# Altium schematic sheet UAV_Main.SchDoc
size 599 x 500 mm; SheetNumber: 1; SheetTotal: 12
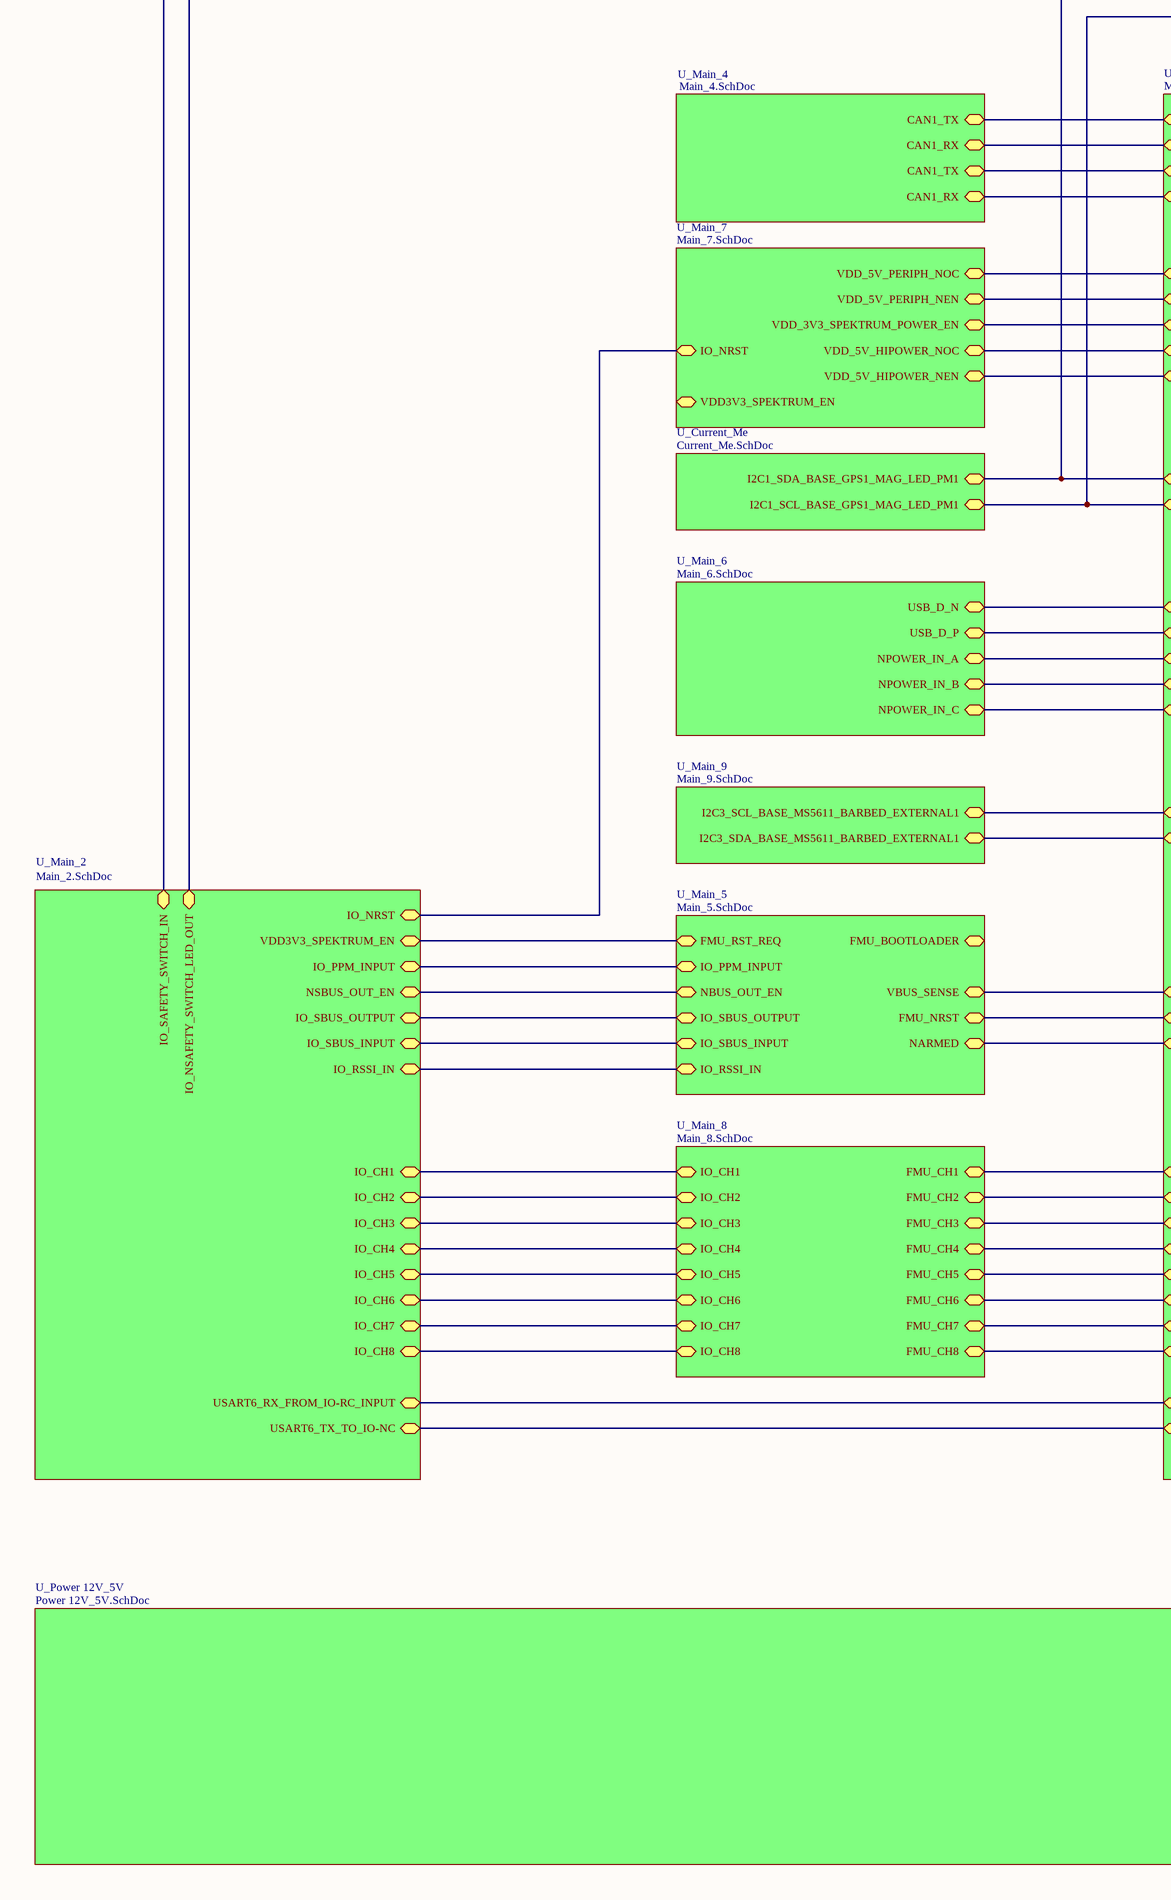
[diagram p0: UAV_Main.SchDoc, left]
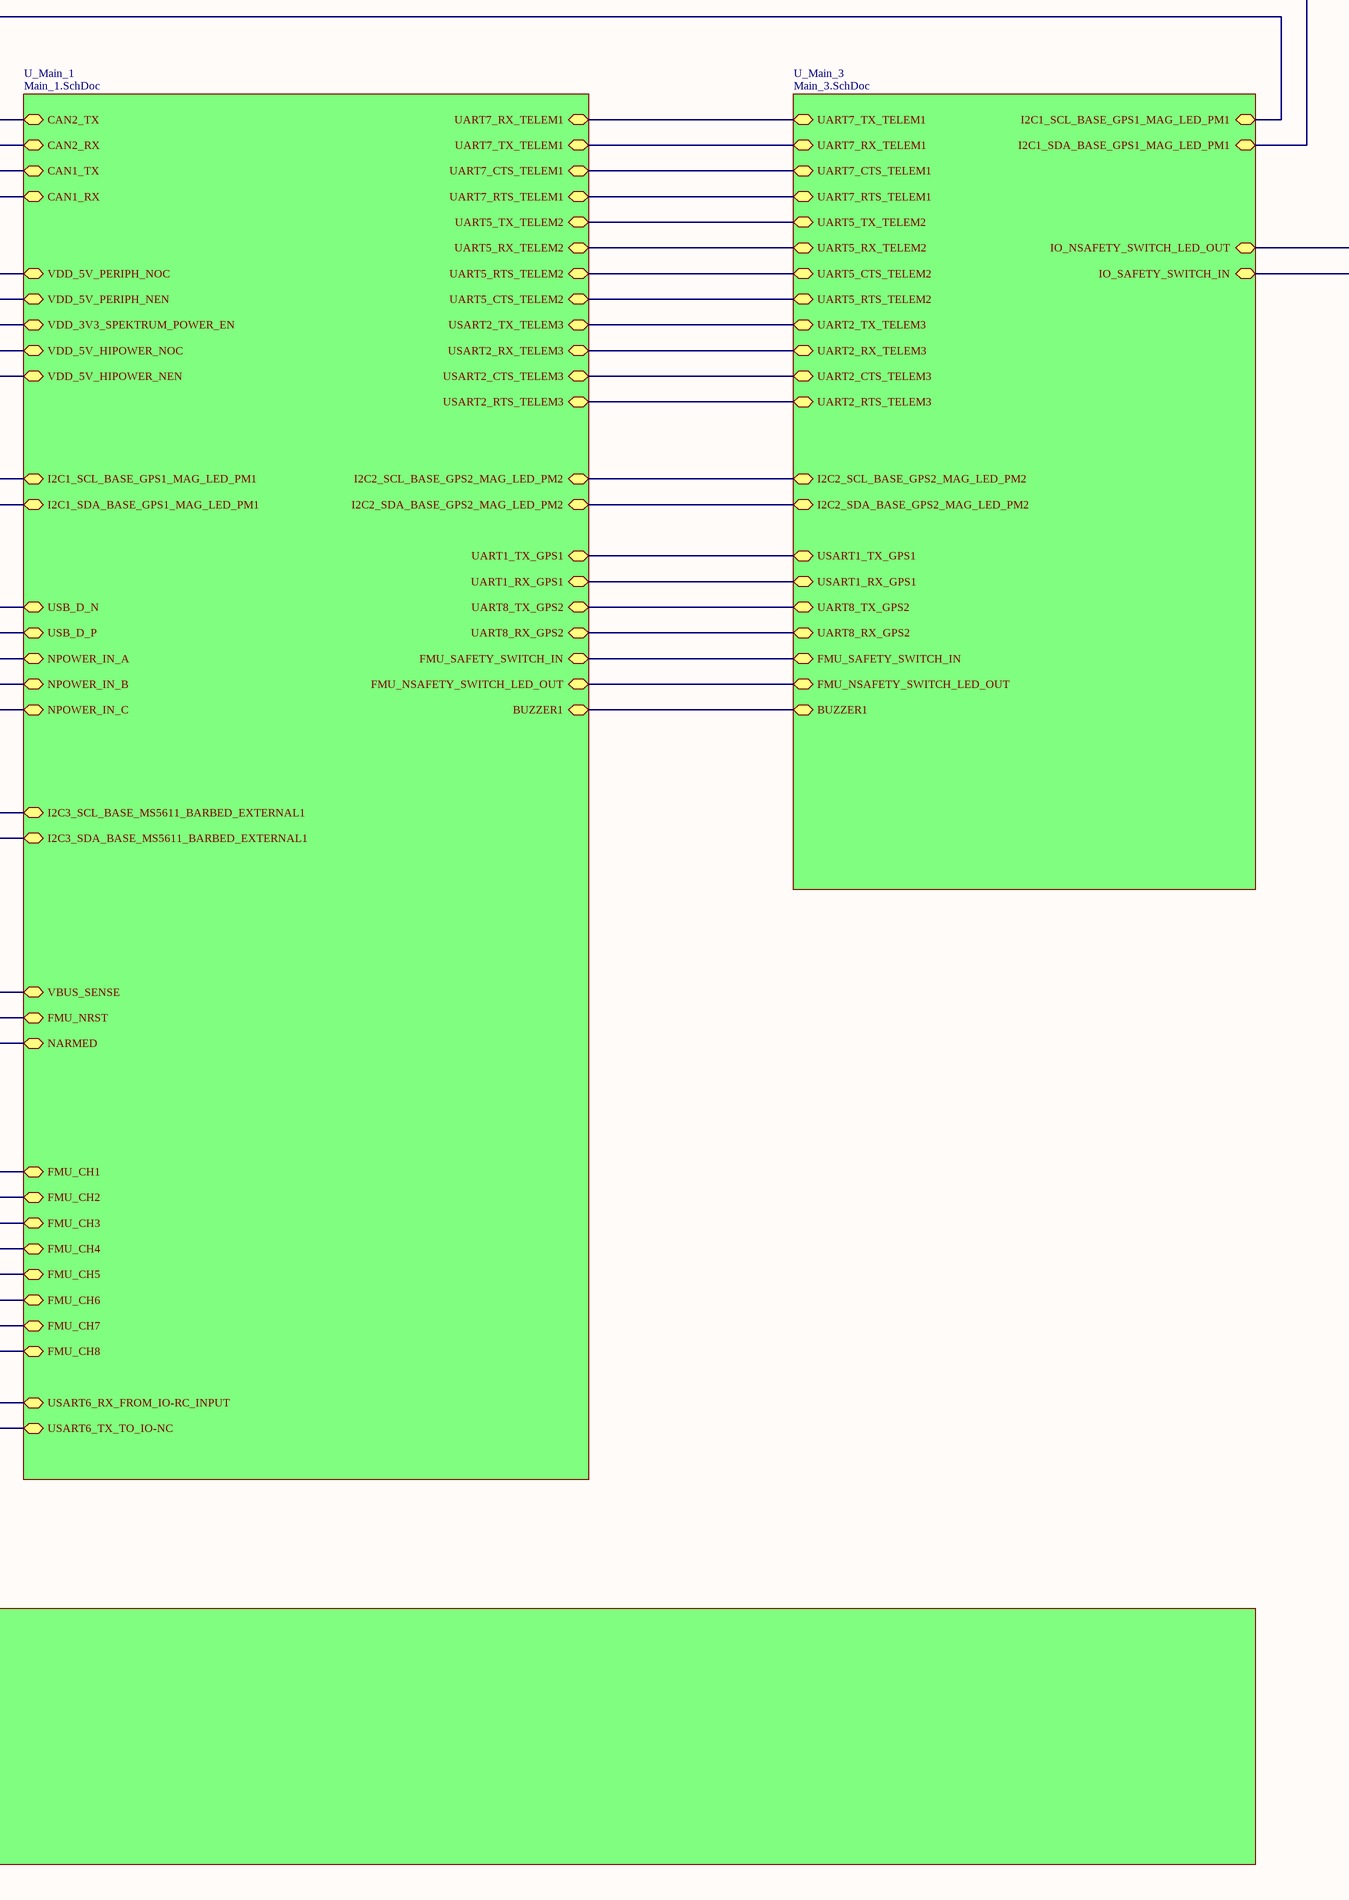
[diagram p1: UAV_Main.SchDoc, right]

## Sub-sheets
U_Current_Me = Current_Me.SchDoc: I2C1_SCL_BASE_GPS1_MAG_LED_PM1 (bidir), I2C1_SDA_BASE_GPS1_MAG_LED_PM1 (bidir)
U_Main_1 = Main_1.SchDoc: FMU_CH5 (bidir), FMU_CH6 (bidir), FMU_CH7 (bidir), FMU_CH8 (bidir), FMU_CH1 (bidir), FMU_CH2 (bidir), FMU_CH3 (bidir), FMU_CH4 (bidir), CAN2_TX (bidir), CAN2_RX (bidir), FMU_NSAFETY_SWITCH_LED_OUT (bidir), VDD_3V3_SPEKTRUM_POWER_EN (bidir), VDD_5V_PERIPH_NEN (bidir), VDD_5V_PERIPH_NOC (bidir), CAN1_TX (bidir), CAN1_RX (bidir), VDD_5V_HIPOWER_NEN (bidir), VDD_5V_HIPOWER_NOC (bidir), NARMED (bidir), FMU_NRST (bidir), NPOWER_IN_A (bidir), NPOWER_IN_B (bidir), NPOWER_IN_C (bidir), USB_D_P (bidir), USB_D_N (bidir), VBUS_SENSE (bidir), USART6_RX_FROM_IO-RC_INPUT (bidir), USART6_TX_TO_IO-NC (bidir), UART7_TX_TELEM1 (bidir), UART7_RX_TELEM1 (bidir), UART5_TX_TELEM2 (bidir), UART5_RX_TELEM2 (bidir), UART5_RTS_TELEM2 (bidir), UART5_CTS_TELEM2 (bidir), USART2_TX_TELEM3 (bidir), USART2_RX_TELEM3 (bidir), USART2_RTS_TELEM3 (bidir), USART2_CTS_TELEM3 (bidir), UART1_RX_GPS1 (bidir), UART1_TX_GPS1 (bidir), UART8_TX_GPS2 (bidir), UART8_RX_GPS2 (bidir), UART7_RTS_TELEM1 (bidir), UART7_CTS_TELEM1 (bidir), I2C1_SCL_BASE_GPS1_MAG_LED_PM1 (bidir), I2C1_SDA_BASE_GPS1_MAG_LED_PM1 (bidir), I2C2_SCL_BASE_GPS2_MAG_LED_PM2 (bidir), I2C2_SDA_BASE_GPS2_MAG_LED_PM2 (bidir), I2C3_SCL_BASE_MS5611_BARBED_EXTERNAL1 (bidir), I2C3_SDA_BASE_MS5611_BARBED_EXTERNAL1 (bidir), BUZZER1 (bidir), FMU_SAFETY_SWITCH_IN (bidir)
U_Main_2 = Main_2.SchDoc: IO_NRST (bidir), VDD3V3_SPEKTRUM_EN (bidir), IO_NSAFETY_SWITCH_LED_OUT (bidir), IO_SBUS_INPUT (bidir), IO_SBUS_OUTPUT (bidir), IO_CH3 (bidir), IO_CH4 (bidir), IO_SAFETY_SWITCH_IN (bidir), NSBUS_OUT_EN (bidir), IO_CH7 (bidir), IO_CH8 (bidir), IO_CH1 (bidir), IO_CH2 (bidir), USART6_RX_FROM_IO-RC_INPUT (bidir), USART6_TX_TO_IO-NC (bidir), IO_RSSI_IN (bidir), IO_CH5 (bidir), IO_CH6 (bidir), IO_PPM_INPUT (bidir)
U_Main_3 = Main_3.SchDoc: UART7_TX_TELEM1 (bidir), UART7_RX_TELEM1 (bidir), UART7_CTS_TELEM1 (bidir), UART7_RTS_TELEM1 (bidir), UART5_TX_TELEM2 (bidir), UART5_RX_TELEM2 (bidir), UART5_CTS_TELEM2 (bidir), UART5_RTS_TELEM2 (bidir), UART2_TX_TELEM3 (bidir), UART2_RX_TELEM3 (bidir), UART2_CTS_TELEM3 (bidir), UART2_RTS_TELEM3 (bidir), USART1_TX_GPS1 (bidir), USART1_RX_GPS1 (bidir), I2C1_SCL_BASE_GPS1_MAG_LED_PM1 (bidir), I2C1_SDA_BASE_GPS1_MAG_LED_PM1 (bidir), IO_SAFETY_SWITCH_IN (bidir), FMU_SAFETY_SWITCH_IN (bidir), FMU_NSAFETY_SWITCH_LED_OUT (bidir), IO_NSAFETY_SWITCH_LED_OUT (bidir), BUZZER1 (bidir), UART8_TX_GPS2 (bidir), UART8_RX_GPS2 (bidir), I2C2_SCL_BASE_GPS2_MAG_LED_PM2 (bidir), I2C2_SDA_BASE_GPS2_MAG_LED_PM2 (bidir)
U_Main_4 = Main_4.SchDoc: CAN1_TX (bidir), CAN1_RX (bidir), CAN1_TX (bidir), CAN1_RX (bidir)
U_Main_5 = Main_5.SchDoc: FMU_BOOTLOADER (bidir), VBUS_SENSE (bidir), FMU_NRST (bidir), NARMED (bidir), FMU_RST_REQ (bidir), IO_PPM_INPUT (bidir), NBUS_OUT_EN (bidir), IO_SBUS_INPUT (bidir), IO_SBUS_OUTPUT (bidir), IO_RSSI_IN (bidir)
U_Main_6 = Main_6.SchDoc: USB_D_N (bidir), USB_D_P (bidir), NPOWER_IN_A (bidir), NPOWER_IN_B (bidir), NPOWER_IN_C (bidir)
U_Main_7 = Main_7.SchDoc: VDD3V3_SPEKTRUM_EN (bidir), VDD_3V3_SPEKTRUM_POWER_EN (bidir), VDD_5V_HIPOWER_NOC (bidir), VDD_5V_HIPOWER_NEN (bidir), IO_NRST (bidir), VDD_5V_PERIPH_NEN (bidir), VDD_5V_PERIPH_NOC (bidir)
U_Main_8 = Main_8.SchDoc: IO_CH5 (bidir), IO_CH6 (bidir), IO_CH7 (bidir), IO_CH8 (bidir), IO_CH1 (bidir), IO_CH2 (bidir), IO_CH3 (bidir), IO_CH4 (bidir), FMU_CH1 (bidir), FMU_CH2 (bidir), FMU_CH3 (bidir), FMU_CH4 (bidir), FMU_CH8 (bidir), FMU_CH7 (bidir), FMU_CH6 (bidir), FMU_CH5 (bidir)
U_Main_9 = Main_9.SchDoc: I2C3_SCL_BASE_MS5611_BARBED_EXTERNAL1 (bidir), I2C3_SDA_BASE_MS5611_BARBED_EXTERNAL1 (bidir)
U_Power 12V_5V = Power 12V_5V.SchDoc: no entries

## Nets
(unnamed): sheet U_Main_8/IO_CH5, sheet U_Main_2/IO_CH5
(unnamed): sheet U_Main_8/IO_CH6, sheet U_Main_2/IO_CH6
(unnamed): sheet U_Main_8/IO_CH7, sheet U_Main_2/IO_CH7
(unnamed): sheet U_Main_8/IO_CH8, sheet U_Main_2/IO_CH8
(unnamed): sheet U_Main_8/IO_CH1, sheet U_Main_2/IO_CH1
(unnamed): sheet U_Main_8/IO_CH2, sheet U_Main_2/IO_CH2
(unnamed): sheet U_Main_8/IO_CH3, sheet U_Main_2/IO_CH3
(unnamed): sheet U_Main_8/IO_CH4, sheet U_Main_2/IO_CH4
(unnamed): sheet U_Main_8/FMU_CH1, sheet U_Main_1/FMU_CH1
(unnamed): sheet U_Main_8/FMU_CH2, sheet U_Main_1/FMU_CH2
(unnamed): sheet U_Main_8/FMU_CH3, sheet U_Main_1/FMU_CH3
(unnamed): sheet U_Main_8/FMU_CH4, sheet U_Main_1/FMU_CH4
(unnamed): sheet U_Main_8/FMU_CH8, sheet U_Main_1/FMU_CH8
(unnamed): sheet U_Main_8/FMU_CH7, sheet U_Main_1/FMU_CH7
(unnamed): sheet U_Main_8/FMU_CH6, sheet U_Main_1/FMU_CH6
(unnamed): sheet U_Main_8/FMU_CH5, sheet U_Main_1/FMU_CH5
(unnamed): sheet U_Main_6/USB_D_N, sheet U_Main_1/USB_D_N
(unnamed): sheet U_Main_6/USB_D_P, sheet U_Main_1/USB_D_P
(unnamed): sheet U_Main_6/NPOWER_IN_A, sheet U_Main_1/NPOWER_IN_A
(unnamed): sheet U_Main_6/NPOWER_IN_B, sheet U_Main_1/NPOWER_IN_B
(unnamed): sheet U_Main_6/NPOWER_IN_C, sheet U_Main_1/NPOWER_IN_C
(unnamed): sheet U_Main_4/CAN1_TX, sheet U_Main_1/CAN2_TX
(unnamed): sheet U_Main_4/CAN1_RX, sheet U_Main_1/CAN2_RX
(unnamed): sheet U_Main_4/CAN1_TX, sheet U_Main_1/CAN1_TX
(unnamed): sheet U_Main_4/CAN1_RX, sheet U_Main_1/CAN1_RX
(unnamed): sheet U_Main_2/IO_NRST, sheet U_Main_7/IO_NRST
(unnamed): sheet U_Main_2/VDD3V3_SPEKTRUM_EN, sheet U_Main_5/FMU_RST_REQ
(unnamed): sheet U_Main_2/IO_NSAFETY_SWITCH_LED_OUT, sheet U_Main_3/IO_NSAFETY_SWITCH_LED_OUT
(unnamed): sheet U_Main_2/IO_SBUS_INPUT, sheet U_Main_5/IO_SBUS_INPUT
(unnamed): sheet U_Main_2/IO_SBUS_OUTPUT, sheet U_Main_5/IO_SBUS_OUTPUT
(unnamed): sheet U_Main_2/IO_SAFETY_SWITCH_IN, sheet U_Main_3/IO_SAFETY_SWITCH_IN
(unnamed): sheet U_Main_2/NSBUS_OUT_EN, sheet U_Main_5/NBUS_OUT_EN
(unnamed): sheet U_Main_2/USART6_RX_FROM_IO-RC_INPUT, sheet U_Main_1/USART6_RX_FROM_IO-RC_INPUT
(unnamed): sheet U_Main_2/USART6_TX_TO_IO-NC, sheet U_Main_1/USART6_TX_TO_IO-NC
(unnamed): sheet U_Main_2/IO_RSSI_IN, sheet U_Main_5/IO_RSSI_IN
(unnamed): sheet U_Main_2/IO_PPM_INPUT, sheet U_Main_5/IO_PPM_INPUT
(unnamed): sheet U_Main_7/VDD_3V3_SPEKTRUM_POWER_EN, sheet U_Main_1/VDD_3V3_SPEKTRUM_POWER_EN
(unnamed): sheet U_Main_7/VDD_5V_HIPOWER_NOC, sheet U_Main_1/VDD_5V_HIPOWER_NOC
(unnamed): sheet U_Main_7/VDD_5V_HIPOWER_NEN, sheet U_Main_1/VDD_5V_HIPOWER_NEN
(unnamed): sheet U_Main_7/VDD_5V_PERIPH_NEN, sheet U_Main_1/VDD_5V_PERIPH_NEN
(unnamed): sheet U_Main_7/VDD_5V_PERIPH_NOC, sheet U_Main_1/VDD_5V_PERIPH_NOC
(unnamed): sheet U_Current_Me/I2C1_SCL_BASE_GPS1_MAG_LED_PM1, sheet U_Main_1/I2C1_SDA_BASE_GPS1_MAG_LED_PM1, sheet U_Main_3/I2C1_SCL_BASE_GPS1_MAG_LED_PM1
(unnamed): sheet U_Current_Me/I2C1_SDA_BASE_GPS1_MAG_LED_PM1, sheet U_Main_1/I2C1_SCL_BASE_GPS1_MAG_LED_PM1, sheet U_Main_3/I2C1_SDA_BASE_GPS1_MAG_LED_PM1
(unnamed): sheet U_Main_1/FMU_NSAFETY_SWITCH_LED_OUT, sheet U_Main_3/FMU_NSAFETY_SWITCH_LED_OUT
(unnamed): sheet U_Main_1/NARMED, sheet U_Main_5/NARMED
(unnamed): sheet U_Main_1/FMU_NRST, sheet U_Main_5/FMU_NRST
(unnamed): sheet U_Main_1/VBUS_SENSE, sheet U_Main_5/VBUS_SENSE
(unnamed): sheet U_Main_1/UART7_TX_TELEM1, sheet U_Main_3/UART7_RX_TELEM1
(unnamed): sheet U_Main_1/UART7_RX_TELEM1, sheet U_Main_3/UART7_TX_TELEM1
(unnamed): sheet U_Main_1/UART5_TX_TELEM2, sheet U_Main_3/UART5_TX_TELEM2
(unnamed): sheet U_Main_1/UART5_RX_TELEM2, sheet U_Main_3/UART5_RX_TELEM2
(unnamed): sheet U_Main_1/UART5_RTS_TELEM2, sheet U_Main_3/UART5_CTS_TELEM2
(unnamed): sheet U_Main_1/UART5_CTS_TELEM2, sheet U_Main_3/UART5_RTS_TELEM2
(unnamed): sheet U_Main_1/USART2_TX_TELEM3, sheet U_Main_3/UART2_TX_TELEM3
(unnamed): sheet U_Main_1/USART2_RX_TELEM3, sheet U_Main_3/UART2_RX_TELEM3
(unnamed): sheet U_Main_1/USART2_RTS_TELEM3, sheet U_Main_3/UART2_RTS_TELEM3
(unnamed): sheet U_Main_1/USART2_CTS_TELEM3, sheet U_Main_3/UART2_CTS_TELEM3
(unnamed): sheet U_Main_1/UART1_RX_GPS1, sheet U_Main_3/USART1_RX_GPS1
(unnamed): sheet U_Main_1/UART1_TX_GPS1, sheet U_Main_3/USART1_TX_GPS1
(unnamed): sheet U_Main_1/UART8_TX_GPS2, sheet U_Main_3/UART8_TX_GPS2
(unnamed): sheet U_Main_1/UART8_RX_GPS2, sheet U_Main_3/UART8_RX_GPS2
(unnamed): sheet U_Main_1/UART7_RTS_TELEM1, sheet U_Main_3/UART7_RTS_TELEM1
(unnamed): sheet U_Main_1/UART7_CTS_TELEM1, sheet U_Main_3/UART7_CTS_TELEM1
(unnamed): sheet U_Main_1/I2C2_SCL_BASE_GPS2_MAG_LED_PM2, sheet U_Main_3/I2C2_SCL_BASE_GPS2_MAG_LED_PM2
(unnamed): sheet U_Main_1/I2C2_SDA_BASE_GPS2_MAG_LED_PM2, sheet U_Main_3/I2C2_SDA_BASE_GPS2_MAG_LED_PM2
(unnamed): sheet U_Main_1/I2C3_SCL_BASE_MS5611_BARBED_EXTERNAL1, sheet U_Main_9/I2C3_SCL_BASE_MS5611_BARBED_EXTERNAL1
(unnamed): sheet U_Main_1/I2C3_SDA_BASE_MS5611_BARBED_EXTERNAL1, sheet U_Main_9/I2C3_SDA_BASE_MS5611_BARBED_EXTERNAL1
(unnamed): sheet U_Main_1/BUZZER1, sheet U_Main_3/BUZZER1
(unnamed): sheet U_Main_1/FMU_SAFETY_SWITCH_IN, sheet U_Main_3/FMU_SAFETY_SWITCH_IN